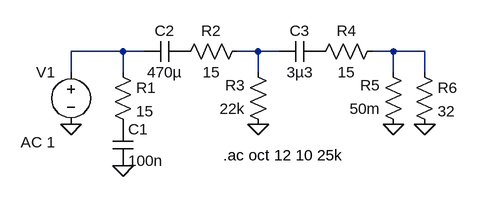
[diagram p0: schematic output_circuit.asc]
output_circuit.asc, the LTspice schematic file:
Version 4
SHEET 1 880 680
WIRE -80 80 -160 80
WIRE -48 80 -80 80
WIRE 128 80 96 80
WIRE 160 80 128 80
WIRE 336 80 304 80
WIRE 384 80 336 80
WIRE -160 112 -160 80
WIRE -80 112 -80 80
WIRE 128 112 128 80
WIRE 336 112 336 80
WIRE 384 112 384 80
FLAG -160 192 0
FLAG -80 256 0
FLAG 128 192 0
FLAG 336 192 0
FLAG 384 192 0
SYMBOL voltage -160 96 M0
WINDOW 123 24 124 Left 2
WINDOW 39 0 0 Left 0
SYMATTR InstName V1
SYMATTR Value ""
SYMATTR Value2 AC 1
SYMBOL res -96 96 R0
SYMATTR InstName R1
SYMATTR Value 15
SYMBOL cap -96 192 R0
SYMATTR InstName C1
SYMATTR Value 100n
SYMBOL cap 16 64 R90
WINDOW 0 0 32 VBottom 2
WINDOW 3 32 32 VTop 2
SYMATTR InstName C2
SYMATTR Value 470µ
SYMBOL res 112 64 R90
WINDOW 0 0 56 VBottom 2
WINDOW 3 32 56 VTop 2
SYMATTR InstName R2
SYMATTR Value 15
SYMBOL res 144 208 R180
WINDOW 0 36 76 Left 2
WINDOW 3 36 40 Left 2
SYMATTR InstName R3
SYMATTR Value 22k
SYMBOL cap 224 64 R90
WINDOW 0 0 32 VBottom 2
WINDOW 3 32 32 VTop 2
SYMATTR InstName C3
SYMATTR Value 3µ3
SYMBOL res 320 64 R90
WINDOW 0 0 56 VBottom 2
WINDOW 3 32 56 VTop 2
SYMATTR InstName R4
SYMATTR Value 15
SYMBOL res 352 208 R180
WINDOW 0 36 76 Left 2
WINDOW 3 36 40 Left 2
SYMATTR InstName R5
SYMATTR Value 50m
SYMBOL res 368 96 R0
SYMATTR InstName R6
SYMATTR Value 32
TEXT 74 240 Left 2 !.ac oct 12 10 25k

The netlist it stands for:
* output_circuit.asc
V1 N001 0 AC 1
R1 N001 P001 15
C1 P001 0 100n
C2 P002 N001 470µ
R2 N002 P002 15
R3 0 N002 22k
C3 P003 N002 3µ3
R4 N003 P003 15
R5 0 N003 50m
R6 N003 0 32
.ac oct 12 10 25k
.backanno
.end